# EAGLE design ATSAMD21 board (EAGLE 7.3.0)
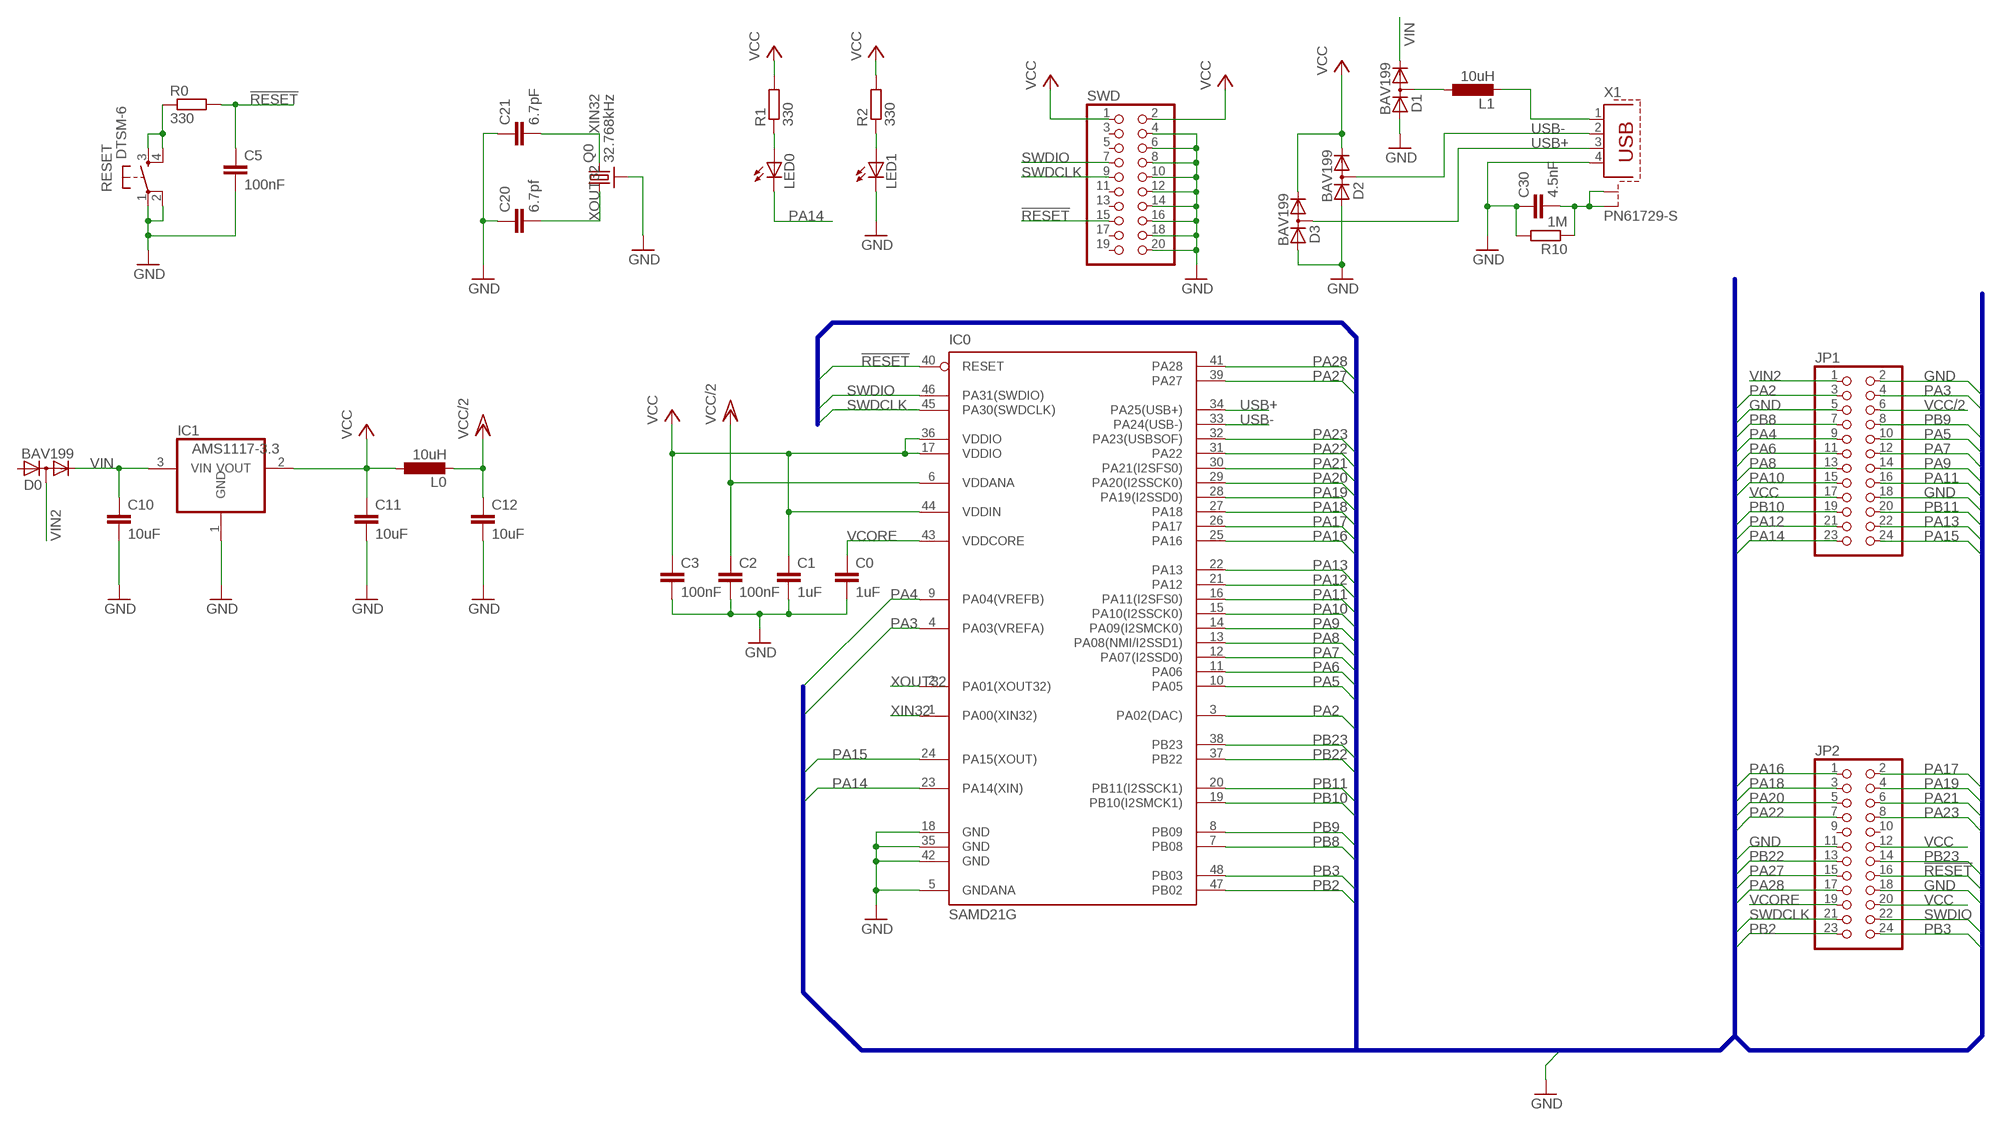
[diagram p0: schematic, sheet 1]

## Parts
C0  1uF  C-EUC0805K  [C0805K]
C1  1uF  C-EUC0805K  [C0805K]
C2  100nF  C-EUC0805K  [C0805K]
C3  100nF  C-EUC0805K  [C0805K]
C5  100nF  C-EUC0805K  [C0805K]
C10  10uF  C-EUC0805K  [C0805K]
C11  10uF  C-EUC0805K  [C0805K]
C12  10uF  C-EUC0805K  [C0805K]
C20  6.7pf  C-EUC0805K  [C0805K]
C21  6.7pF  C-EUC0805K  [C0805K]
C30  4.5nF  C-EUC0805K  [C0805K]
D0  BAV199  [SOT23]
D1  BAV199  [SOT23]
D2  BAV199  [SOT23]
D3  BAV199  [SOT23]
IC0  SAMD21G  [TQFP48]
IC1  AMS1117-3.3  REG1117  [SOT223]
JP1  PINHD-2X12  [2X12]
JP2  PINHD-2X12  [2X12]
L0  10uH  L-EUL2012C  [L2012C]
L1  10uH  L-EUL2012C  [L2012C]
LED0  LEDCHIP-LED0805  [CHIP-LED0805]
LED1  LEDCHIP-LED0805  [CHIP-LED0805]
Q0  32.768kHz  CRYSTALTC26H  [TC26H]
R0  330  R-EU_R0805  [R0805]
R1  330  R-EU_R0805  [R0805]
R2  330  R-EU_R0805  [R0805]
R10  1M  R-EU_R0805  [R0805]
RESET  DTSM-6  [DTSM-6]
SWD  PINHD-2X10  [2X10]
X1  PN61729-S  [PN61729-S]

## Nets
!RESET: C5.1 IC0.40(RESET) JP2.16 R0.2 SWD.15
GND [pwr]: C0.2 C1.2 C2.2 C3.2 C5.2 C10.2 C11.2 C12.2 C20.1 C21.1 C30.1 D1.1(A) D2.1(A) D3.1(A) IC0.5(GNDANA) IC0.18(GND) IC0.35(GND) IC0.42(GND) IC1.1(GND) JP1.2 JP1.5 JP1.18 JP2.11 JP2.18 LED1.C Q0.P$1 R10.2 RESET.1 RESET.2 SWD.4 SWD.6 SWD.8 SWD.10 SWD.12 SWD.14 SWD.16 SWD.18 SWD.20 X1.4
N$1: C30.2 R10.1 X1.S1 X1.S2
N$2: R0.1 RESET.3 RESET.4
N$3: L1.2 X1.1
N$4: D1.3(AC) L1.1
N$5: LED0.A R1.1
N$6: LED1.A R2.1
PA2: IC0.3(PA02(DAC)) JP1.3
PA3: IC0.4(PA03(VREFA)) JP1.4
PA4: IC0.9(PA04(VREFB)) JP1.9
PA5: IC0.10(PA05) JP1.10
PA6: IC0.11(PA06) JP1.11
PA7: IC0.12(PA07(I2SSD0)) JP1.12
PA8: IC0.13(PA08(NMI/I2SSD1)) JP1.13
PA9: IC0.14(PA09(I2SMCK0)) JP1.14
PA10: IC0.15(PA10(I2SSCK0)) JP1.15
PA11: IC0.16(PA11(I2SFS0)) JP1.16
PA12: IC0.21(PA12) JP1.21
PA13: IC0.22(PA13) JP1.22
PA14: IC0.23(PA14(XIN)) JP1.23 LED0.C
PA15: IC0.24(PA15(XOUT)) JP1.24
PA16: IC0.25(PA16) JP2.1
PA17: IC0.26(PA17) JP2.2
PA18: IC0.27(PA18) JP2.3
PA19: IC0.28(PA19(I2SSD0)) JP2.4
PA20: IC0.29(PA20(I2SSCK0)) JP2.5
PA21: IC0.30(PA21(I2SFS0)) JP2.6
PA22: IC0.31(PA22) JP2.7
PA23: IC0.32(PA23(USBSOF)) JP2.8
PA27: IC0.39(PA27) JP2.15
PA28: IC0.41(PA28) JP2.17
PB2: IC0.47(PB02) JP2.23
PB3: IC0.48(PB03) JP2.24
PB8: IC0.7(PB08) JP1.7
PB9: IC0.8(PB09) JP1.8
PB10: IC0.19(PB10(I2SMCK1)) JP1.19
PB11: IC0.20(PB11(I2SSCK1)) JP1.20
PB22: IC0.37(PB22) JP2.13
PB23: IC0.38(PB23) JP2.14
SWDCLK: IC0.45(PA30(SWDCLK)) JP2.21 SWD.9
SWDIO: IC0.46(PA31(SWDIO)) JP2.22 SWD.7
USB+: D3.3(AC) IC0.34(PA25(USB+)) X1.3
USB-: D2.3(AC) IC0.33(PA24(USB-)) X1.2
VCC [pwr]: C1.1 C3.1 C11.1 D2.2(C) D3.2(C) IC0.17(VDDIO) IC0.36(VDDIO) IC0.44(VDDIN) IC1.2(VOUT) JP1.17 JP2.12 JP2.20 L0.1 R1.2 R2.2 SWD.1 SWD.2
VCC/2: C2.1 C12.1 IC0.6(VDDANA) JP1.6 L0.2
VCORE: C0.1 IC0.43(VDDCORE) JP2.19
VIN: C10.1 D0.2(C) D1.2(C) IC1.3(VIN)
VIN2: D0.3(AC) JP1.1
XIN32: C21.2 IC0.1(PA00(XIN32)) Q0.2
XOUT32: C20.2 IC0.2(PA01(XOUT32)) Q0.1
Unconnected: D0.1(A) JP2.9 JP2.10 SWD.3 SWD.5 SWD.11 SWD.13 SWD.17 SWD.19

## Buses
PA[0..31],PB[2..23],!RESET,SWDIO,SWDCLK,GND

## Library data of the parts
C0 C1-C3 C5 C10-C12 C20 C21 C30 = rcl:C-EU: CAPACITOR, European symbol
D0 D1-D3 = diode:BAV199: DIODE low-leakage double diode
IC0 = atsamd21:SAMD21G: Atmel SAM D21G SMART ARM-Based Microcontroller
IC1 = burr-brown:REG1117: 800mA and 1A Low Dropout (LDO) Positive Regulator 1.8V, 2.5V, 2.85V, 3.3V, 5V, and Adj; MPN: REG1117; OC_FARNELL: 1097566; OC_NEWARK: 14P6981
JP1 JP2 = pinhead:PINHD-2X12: PIN HEADER
L0 L1 = rcl:L-EU: INDUCTOR, European symbol
LED0 LED1 = led:LED: LED OSRAM: - CHIPLED LG R971, LG N971, LY N971, LG Q971, LY Q971, LO R971, LY R971 LH N974, LH R974 LS Q976, LO Q976, LY Q976 LO Q996 - Hyper CHIPLED LW Q18S LB Q993, LB Q99A, LB R99A - SideLED LS A670, LO A670, LY A670, LG A670, LP A670 LB A673, LV A673, LT A673, LW A673 LH A674 LY A675 LS A676, LA A676, LO A676, LY A676, LW A676 LS A679, LY A679, LG A679 - Hyper Micro SIDELED® LS Y876, LA Y876, LO Y876, LY Y876 LT Y87S - SmartLED LW L88C, LW L88S LB L89C, LB L89S, LG L890 LS L89K, LO L89K, LY L89K LS L896, LA L896, LO L896, LY L896 - TOPLED LS T670, LO T670, LY T670, LG T670, LP T670 LSG T670, LSP T670, LSY T670, LOP T670, LYG T670 LG T671, LOG T671, LSG T671 LB T673, LV T673, LT T673, LW T673 LH T674 LS T676, LA T676, LO T676, LY T676, LB T676, LH T676, LSB T676, LW T676 LB T67C, LV T67C, LT T67C, LS T67K, LO T67K, LY T67K, LW E67C LS E67B, LA E67B, LO E67B, LY E67B, LB E67C, LV E67C, LT E67C LW T67C LS T679, LY T679, LG T679 LS T770, LO T770, LY T770, LG T770, LP T770 LB T773, LV T773, LT T773, LW T773 LH T774 LS E675, LA E675, LY E675, LS T675 LS T776, LA T776, LO T776, LY T776, LB T776 LHGB T686 LT T68C, LB T68C - Hyper Mini TOPLED® LB M676 - Mini TOPLED Santana® LG M470 LS M47K, LO M47K, LY M47K Source: http://www.osram.convergy.de LUXEON: - LUMILED® LXK2-PW12-R00, LXK2-PW12-S00, LXK2-PW14-U00, LXK2-PW14-V00 LXK2-PM12-R00, LXK2-PM12-S00, LXK2-PM14-U00 LXK2-PE12-Q00, LXK2-PE12-R00, LXK2-PE12-S00, LXK2-PE14-T00, LXK2-PE14-U00 LXK2-PB12-K00, LXK2-PB12-L00, LXK2-PB12-M00, LXK2-PB14-N00, LXK2-PB14-P00, LXK2-PB14-Q00 LXK2-PR12-L00, LXK2-PR12-M00, LXK2-PR14-Q00, LXK2-PR14-R00 LXK2-PD12-Q00, LXK2-PD12-R00, LXK2-PD12-S00 LXK2-PH12-R00, LXK2-PH12-S00 LXK2-PL12-P00, LXK2-PL12-Q00, LXK2-PL12-R00 Source: www.luxeon.com KINGBRIGHT: KA-3528ASYC Source: www.kingbright.com
Q0 = crystal:CRYSTAL: CRYSTAL; OC_FARNELL: unknown; OC_NEWARK: unknown
R0 R1 R2 R10 = rcl:R-EU_: RESISTOR, European symbol
RESET = switch-tact:DTSM-6
SWD = pinhead:PINHD-2X10: PIN HEADER
X1 = usb-conn:PN61729-S: BERG USB connector; OC_FARNELL: unknown; OC_NEWARK: unknown

## Net classes
0 default: width 0.254 mm, clearance 0.2 mm
1 pwr: width 0.254 mm, clearance 0.2 mm

## Board
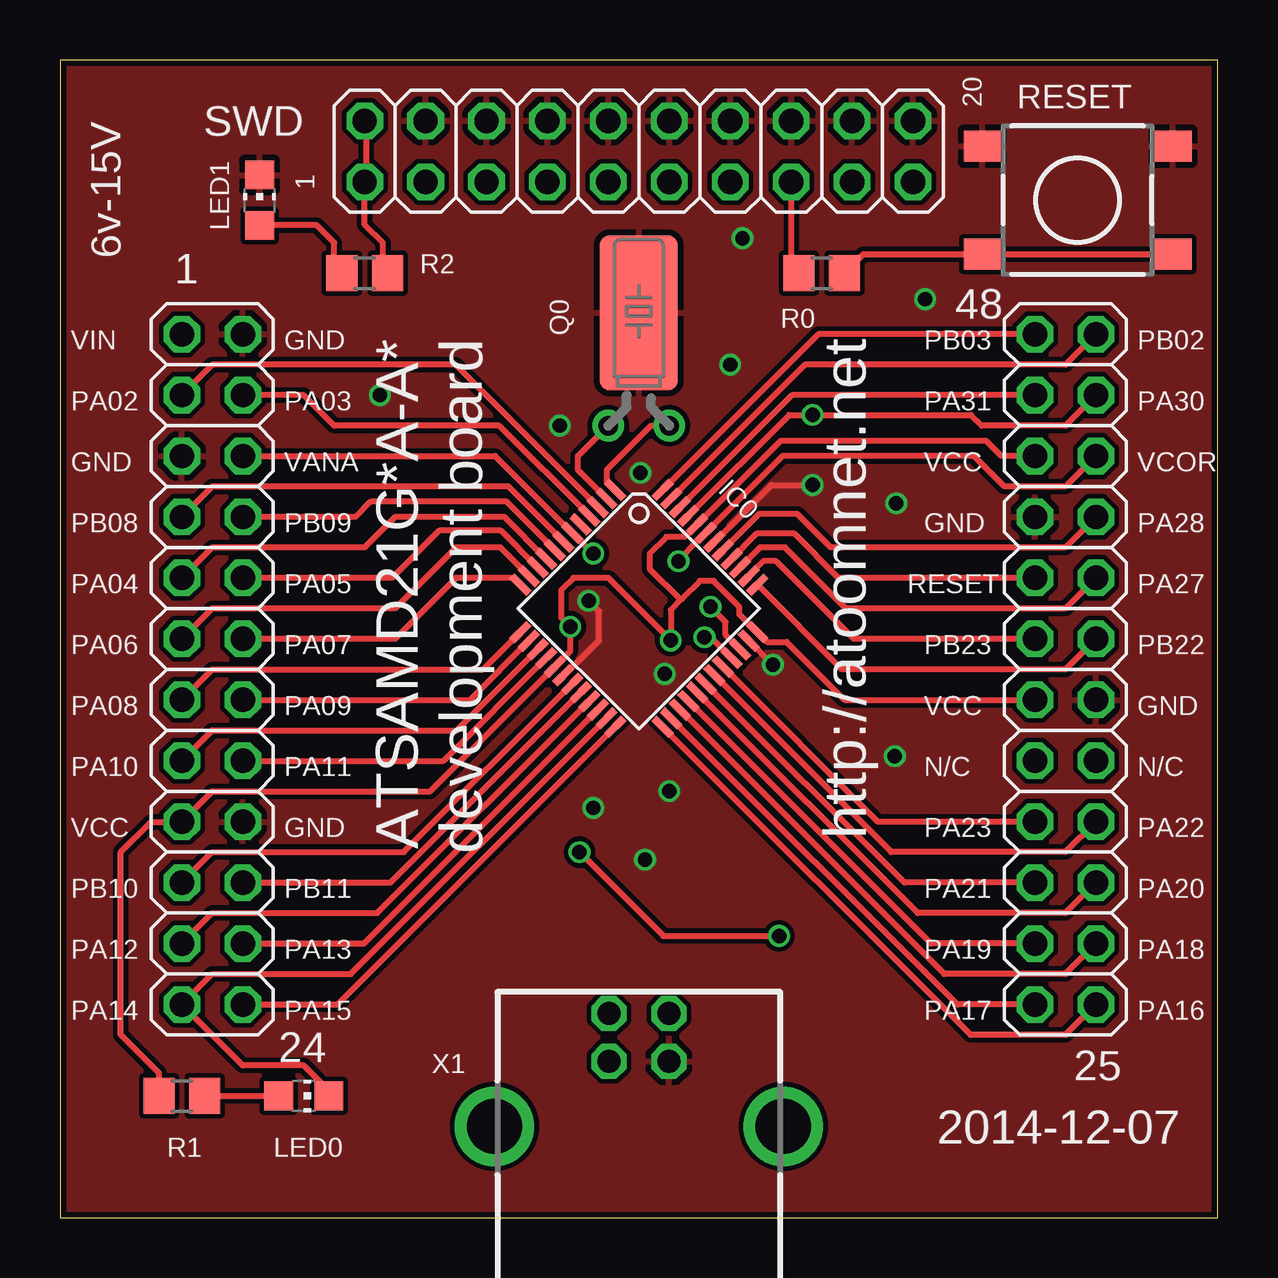
[diagram p1: board, top side]
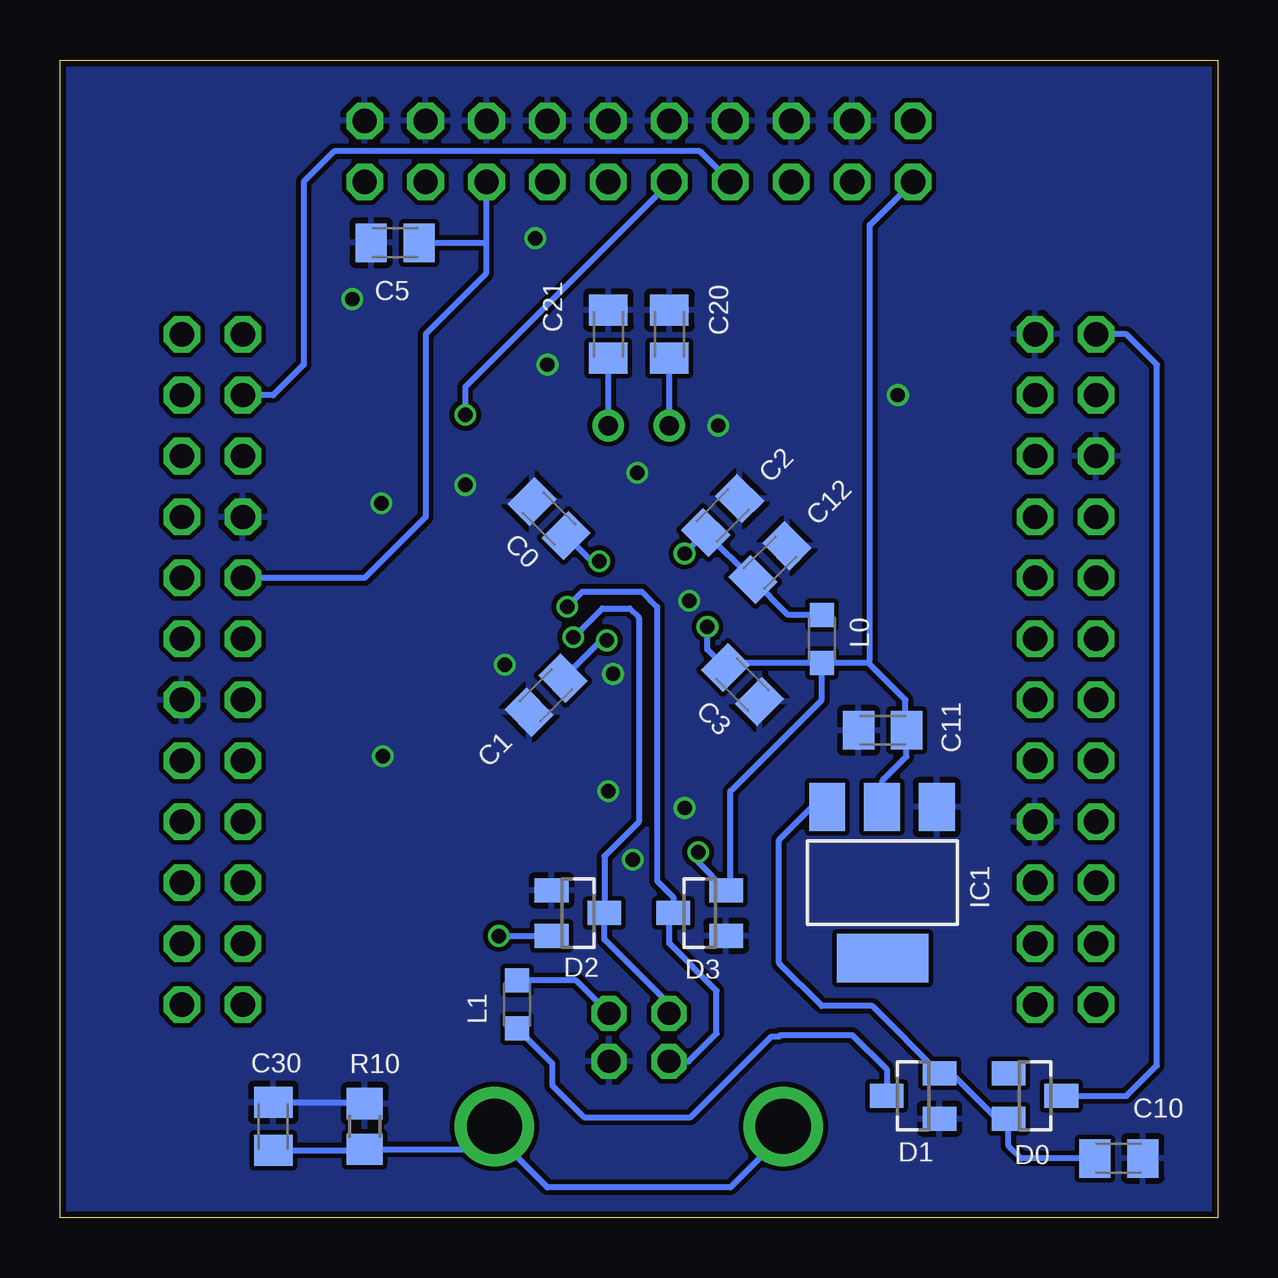
[diagram p2: board, bottom side, seen from below]

Size 48.26 x 48.26 mm. Coordinates in mm from the lower left corner, seen from the top.
Outline: 0,0 48.26,0 48.26,48.26 0,48.26 0,0
Copper layers (1*16): Top 0.035mm / dielectric 1.5mm / Bottom 0.035mm
Design rules "ITEADstudio_DRC": minimum track width 6mil, minimum drill 12mil, track to track 6mil, track to pad 6mil, pad to pad 6mil, via to via 6mil, smd to smd 0mil, copper to edge 10mil, drill to drill 10mil, minimum pad ring 10mil, minimum via ring 6mil, stop-mask expansion 2mil, vias tented up to drill 100mil, thermal gap 10mil
vRestrict: area 0,8.9 to 3.8,39.4; area 44.5,7.6 to 48.3,38.1; area 8.9,8.9 to 12.7,39.4; area 35.6,7.6 to 39.4,38.1

### Footprints (pad centres in the part's own frame; a part is rotated, then mirrored left to right if it is on the bottom)
C0805K = smd 1.3 x 1.6: 1 -1,0; 2 1,0
SOT23 = smd 1 x 1.4: 1 -0.95,-1.1; 2 0.95,-1.1; 3 0,1.1
TQFP48 = smd 1.016 x 0.305: 1 -4.191,2.794; 2 -4.191,2.286; 3 -4.191,1.778; 4 -4.191,1.27; 5 -4.191,0.762; 6 -4.191,0.254; 7 -4.191,-0.254; 8 -4.191,-0.762; 9 -4.191,-1.27; 10 -4.191,-1.778; 11 -4.191,-2.286; 12 -4.191,-2.794; 25 4.191,-2.794; 26 4.191,-2.286; 27 4.191,-1.778; 28 4.191,-1.27; 29 4.191,-0.762; 30 4.191,-0.254; 31 4.191,0.254; 32 4.191,0.762; 33 4.191,1.27; 34 4.191,1.778; 35 4.191,2.286; 36 4.191,2.794 | smd 0.305 x 1.016: 13 -2.794,-4.191; 14 -2.286,-4.191; 15 -1.778,-4.191; 16 -1.27,-4.191; 17 -0.762,-4.191; 18 -0.254,-4.191; 19 0.254,-4.191; 20 0.762,-4.191; 21 1.27,-4.191; 22 1.778,-4.191; 23 2.286,-4.191; 24 2.794,-4.191; 37 2.794,4.191; 38 2.286,4.191; 39 1.778,4.191; 40 1.27,4.191; 41 0.762,4.191; 42 0.254,4.191; 43 -0.254,4.191; 44 -0.762,4.191; 45 -1.27,4.191; 46 -1.778,4.191; 47 -2.286,4.191; 48 -2.794,4.191
SOT223 = smd 1.499 x 2.007: 1 -2.261,-3.15; 2 0.025,-3.15; 3 2.311,-3.15 | smd 3.81 x 2.007: 4 0,3.15
2X12 = drill 1.016 octagon: 1 -13.97,-1.27; 2 -13.97,1.27; 3 -11.43,-1.27; 4 -11.43,1.27; 5 -8.89,-1.27; 6 -8.89,1.27; 7 -6.35,-1.27; 8 -6.35,1.27; 9 -3.81,-1.27; 10 -3.81,1.27; 11 -1.27,-1.27; 12 -1.27,1.27; 13 1.27,-1.27; 14 1.27,1.27; 15 3.81,-1.27; 16 3.81,1.27; 17 6.35,-1.27; 18 6.35,1.27; 19 8.89,-1.27; 20 8.89,1.27; 21 11.43,-1.27; 22 11.43,1.27; 23 13.97,-1.27; 24 13.97,1.27
L2012C = smd 1 x 1: 1 -1,0; 2 1,0
CHIP-LED0805 = smd 1.2 x 1.2: A 0,-1.05; C 0,1.05
TC26H = drill 0.813: 1 -1.27,0; 2 1.27,0 | smd 3.251 x 6.452: P$1 0,4.699
R0805 = smd 1.3 x 1.5: 1 -0.95,0; 2 0.95,0
DTSM-6 = smd 1.55 x 1.3: 1 -3.975,2.25; 2 3.975,2.25; 3 -3.975,-2.25; 4 3.975,-2.25
2X10 = drill 1.016 octagon: 1 -11.43,-1.27; 2 -11.43,1.27; 3 -8.89,-1.27; 4 -8.89,1.27; 5 -6.35,-1.27; 6 -6.35,1.27; 7 -3.81,-1.27; 8 -3.81,1.27; 9 -1.27,-1.27; 10 -1.27,1.27; 11 1.27,-1.27; 12 1.27,1.27; 13 3.81,-1.27; 14 3.81,1.27; 15 6.35,-1.27; 16 6.35,1.27; 17 8.89,-1.27; 18 8.89,1.27; 19 11.43,-1.27; 20 11.43,1.27
PN61729-S = drill 0.95 octagon: 1 1.25,4.71; 2 -1.25,4.71; 3 -1.25,2.71; 4 1.25,2.71 | drill 2.3 pad 2.9: S1 -6.02,0; S2 6.02,0

### Placement (x,y rotation side)
C0  27.88,29.15 135 bottom
C1  28,21.78 225 bottom
C2  20.64,29.27 45 bottom
C3  19.81,22.23 315 bottom
C5  34.29,40.64 180 bottom
C10  4.13,2.48 0 bottom
C11  13.97,20.32 180 bottom
C12  18.67,27.3 45 bottom
C20  22.86,36.83 270 bottom
C21  25.4,36.83 270 bottom
C30  39.37,3.81 270 bottom
D0  7.62,5.08 270 bottom
D1  12.7,5.08 90 bottom
D2  26.67,12.7 270 bottom
D3  21.59,12.7 90 bottom
IC0  24.13,25.4 315 top
IC1  13.97,13.97 180 bottom
JP1  6.35,22.86 270 top
JP2  41.91,22.86 90 top
L0  16.51,24.13 90 bottom
L1  29.21,8.89 90 bottom
LED0  10.16,5.08 270 top
LED1  8.32,42.42 0 top
Q0  24.13,33.02 0 top
R0  31.75,39.37 180 top
R1  5.08,5.08 180 top
R2  12.7,39.37 0 top
R10  35.56,3.81 90 bottom
RESET  42.42,42.42 0 top
SWD  24.13,44.45 0 top
X1  24.13,3.81 0 top

### Tracks (layer width: path | path; a pad name or v marks a point on that pad's centre or on a via)
!RESET
  Top 0.254: JP2.16 32.45,26.67 30.61,28.51 29.04,28.51 IC0.40 | R0.2 30.48,39.69 SWD.15
  Bottom 0.254: SWD.15 30.5,43.12 30.5,40.64 | 40.62,26.75 JP2.16 35.56,26.67 33.02,29.21 33.02,36.83 30.5,39.35 30.5,40.64 | C5.1 30.5,40.64
GND  (via drill 0.6)
  Top 0.254: IC0.18 21.03,22.62 22.48,24.07 22.48,25.27 v22.04,25.72 | IC0.35 v29.72,23.05 | IC0.42 27.27,28.23 27.34,28.23 29.65,30.54 v31.37,30.54
  Bottom 0.254: C30.1 35.61,4.81 R10.2
  other vias: 24.38,14.92 25.4,17.78 22.23,17.08 20.83,33.02 24.19,31.05 34.86,29.78 36.07,38.29 28.45,40.83 34.8,19.24 27.94,35.56 13.34,34.29 25.21,22.67
  pour Bottom: -1.27,49.53 49.53,49.53 49.53,-1.27 -1.27,-1.27
  pour Top: -2.54,50.8 50.8,50.8 50.8,-2.54 -2.54,-2.54
N$1
  Bottom 0.254: X1.S1 18.11,3.48 20.32,1.27 27.94,1.27 30.15,3.48 X1.S2 31.1,2.86 R10.1 35.61,2.81 C30.2
N$2
  Top 0.254: R0.1 33.5,40.17 RESET.3 RESET.4
N$3
  Bottom 0.254: X1.1 26.75,9.89 L1.2
N$4
  Bottom 0.254: L1.1 27.75,6.43 27.75,5.52 26.42,4.19 21.97,4.19 18.61,7.56 18.29,7.56 18.22,7.62 15.24,7.62 13.8,6.18 D1.3
N$5
  Top 0.254: R1.1 LED0.A
N$6
  Top 0.254: R2.1 11.43,39.69 11.43,40.64 10.7,41.37 LED1.A
PA2
  Top 0.254: IC0.3 16.48,35.56 6.35,35.56 JP1.3
PA3
  Top 0.254: IC0.4 18.31,33.02 11.43,33.02 10.16,34.29 JP1.4
PA4
  Top 0.254: IC0.9 18.52,29.21 13.97,29.21 12.7,27.94 6.35,27.94 JP1.9
PA5
  Top 0.254: IC0.10 18.38,28.64 15.81,28.64 13.84,26.67 JP1.10
PA6
  Top 0.254: IC0.11 18.36,27.94 16.51,27.94 13.97,25.4 6.35,25.4 JP1.11
PA7
  Top 0.254: IC0.12 18.91,26.67 16.51,26.67 13.97,24.13 JP1.12
PA8
  Top 0.254: JP1.13 6.35,22.86 17.64,22.86 IC0.13
PA9
  Top 0.254: JP1.14 17.09,21.59 IC0.14
PA10
  Top 0.254: JP1.15 6.35,20.32 16.54,20.32 IC0.15
PA11
  Top 0.254: JP1.16 15.98,19.05 IC0.16
PA12
  Top 0.254: JP1.21 6.35,12.7 13.23,12.7 IC0.21
PA13
  Top 0.254: JP1.22 12.67,11.43 IC0.22
PA14
  Top 0.254: IC0.23 12.12,10.16 6.35,10.16 JP1.23 7.62,6.35 10.16,6.35 11.21,5.3 LED0.C
PA15
  Top 0.254: JP1.24 11.57,8.89 IC0.24
PA16
  Top 0.254: JP2.1 41.91,7.62 37.96,7.62 IC0.25
PA17
  Top 0.254: JP2.2 37.41,8.89 IC0.26
PA18
  Top 0.254: JP2.3 41.91,10.16 36.86,10.16 IC0.27
PA19
  Top 0.254: JP2.4 36.3,11.43 IC0.28
PA20
  Top 0.254: JP2.5 41.91,12.7 35.75,12.7 IC0.29
PA21
  Top 0.254: JP2.6 35.2,13.97 IC0.30
PA22
  Top 0.254: JP2.7 41.91,15.24 34.65,15.24 IC0.31
PA23
  Top 0.254: JP2.8 34.1,16.51 IC0.32
PA27
  Top 0.254: JP2.15 41.91,25.4 32.77,25.4 30.23,27.94 29.18,27.94 IC0.39
PA28
  Top 0.254: JP2.17 41.91,27.94 32.13,27.94 30.73,29.34 29.14,29.34 IC0.41
PB2
  Top 0.254: JP2.23 41.91,35.56 31.06,35.56 IC0.47
PB3
  Top 0.254: JP2.24 31.61,36.83 IC0.48
PB8
  Top 0.254: IC0.7 18.69,30.48 6.35,30.48 JP1.7
PB9
  Top 0.254: IC0.8 18.61,29.84 12.95,29.84 12.32,29.21 JP1.8
PB10
  Top 0.254: JP1.19 6.35,15.24 14.33,15.24 IC0.19
PB11
  Top 0.254: JP1.20 13.78,13.97 IC0.20
PB22
  Top 0.254: JP2.13 41.91,22.86 32.6,22.86 IC0.37
PB23
  Top 0.254: JP2.14 33.08,24.13 29.84,27.37 29.33,27.37 IC0.38
SWDCLK  (via drill 0.6)
  Top 0.254: JP2.21 41.91,33.02 38.42,33.02 37.97,33.47 v31.37,33.47 30.4,33.47 IC0.45
  Bottom 0.254: SWD.9 22.88,43.12 31.37,34.63 v31.37,33.47
SWDIO
  Top 0.254: JP2.22 30.51,34.29 IC0.46
  Bottom 0.254: SWD.7 21.59,44.45 36.83,44.45 38.1,43.18 38.1,35.56 39.37,34.29 JP2.22
USB+  (via drill 0.6)
  Top 0.254: IC0.34 27.75,24.3 27.75,24.83 v27.11,25.46
  Bottom 0.254: X1.3 22.05,6.52 20.89,7.68 20.89,9.46 22.86,11.43 22.86,12.53 D3.3 22.69,13.36 23.37,14.03 23.37,25.46 24,26.1 26.48,26.1 v27.11,25.46
USB-  (via drill 0.6)
  Top 0.254: IC0.33 27.13,24.19 v26.86,24.19
  Bottom 0.254: X1.2 22.88,8.91 25.57,11.6 D2.3 25.57,15.07 24.13,16.51 24.13,25.02 24.51,25.4 25.65,25.4 v26.86,24.19
VCC  (via drill 0.6)
  Top 0.254: 25.91,25.78 26.67,26.54 27.24,26.54 28.32,25.46 28.32,25.15 29.05,24.41 IC0.36 29.48,24 30.29,24 32.7,21.59 JP2.12 | 25.91,25.78 25.46,25.34 v25.46,24.07 22.86,26.67 21.4,26.67 20.89,26.16 20.89,25.02 v21.27,24.64 21.27,23.62 IC0.17 | 25.91,25.78 25.84,25.78 24.57,27.05 24.57,27.69 25.27,28.38 26.04,28.38 IC0.44 30.04,32.38 38.61,32.38 39.24,31.75 JP2.20 | v21.65,15.24 25.15,11.75 v29.97,11.75 | IC0.17 | SWD.2 12.75,45.62 12.75,43.25 SWD.1 12.7,41.4 13.46,40.64 13.46,39.56 R2.2 | IC0.17 15.43,17.78 6.35,17.78 JP1.17 3.81,16.51 2.54,15.24 2.54,7.62 4.13,6.03 R1.2
  Bottom 0.254: v25.46,24.07 25.72,24.07 C1.1 | L0.1 20.32,23.13 C3.1 21.27,23.68 v21.27,24.64 | IC1.2 13.97,17.14 13.97,18.22 12.97,19.22 C11.1 13.02,20.37 13.02,21.59 14.56,23.13 | L0.1 16.51,21.59 20.32,17.78 20.32,13.82 D3.2 21.65,14.81 v21.65,15.24 | 14.56,23.13 L0.1 | v29.97,11.75 D2.2 | SWD.1 12.75,43.12 14.5,41.38 14.5,23.25 14.56,23.13
VCC/2  (via drill 0.6)
  Top 0.254: 22.2,27.69 v22.23,27.69 21.37,28.54 IC0.6 18.14,31.75 JP1.6
  Bottom 0.254: L0.2 17.91,25.13 C12.1 C2.1 v22.23,27.69
VCORE  (via drill 0.6)
  Top 0.254: v25.78,27.37 26.6,28.25 IC0.43 30.12,31.75 38.1,31.75 39.37,30.48 41.91,30.48 JP2.19
  Bottom 0.254: v25.78,27.37 26.1,27.37 C0.1
VIN
  Bottom 0.254: IC1.3 16.92,17.12 18.29,15.75 18.29,10.6 16.51,8.83 14.4,8.83 D1.2 11.11,6.03 9.21,4.13 D0.2 8.72,3 8.19,2.48 C10.1
VIN2
  Bottom 0.254: D0.3 3.81,5.08 2.54,6.35 2.54,35.56 3.81,36.83 JP1.1
XIN32
  Top 0.254: IC0.1 22.8,30.68 22.8,31.18 24.64,33.02 Q0.2
  Bottom 0.254: Q0.2 C21.2
XOUT32
  Top 0.254: IC0.2 21.59,31.17 21.59,31.75 Q0.1
  Bottom 0.254: Q0.1 C20.2

### Text on the board
tNames: 20 | 1 | 6v-15V | 1 | 48 | ATSAMD21G*A-A* / development board | http://atoomnet.net | VIN | GND | PB03 | PB02 | PA02 | PA03 | PA31 | PA30 | GND | VANA | VCC | VCOR | PB08 | PB09 | GND | PA28 | PA04 | PA05 | RESET | PA27 | PA06 | PA07 | PB23 | PB22 | PA08 | PA09 | VCC | GND | PA10 | PA11 | N/C | N/C | VCC | GND | PA23 | PA22 | PB10 | PB11 | PA21 | PA20 | PA12 | PA13 | PA19 | PA18 | PA14 | PA15 | 24 | PA17 | PA16 | 25 | 2014-12-07